# Altium schematic sheet 03_MSP430_AFE.SchDoc: Wearable Ultra Low-Power Ultrasound probe
size A3; DrawnBy: Sebastian Frey; Organization: Integrated Systems Laboratory; Revision: v1.2; SheetNumber: 4; SheetTotal: 6
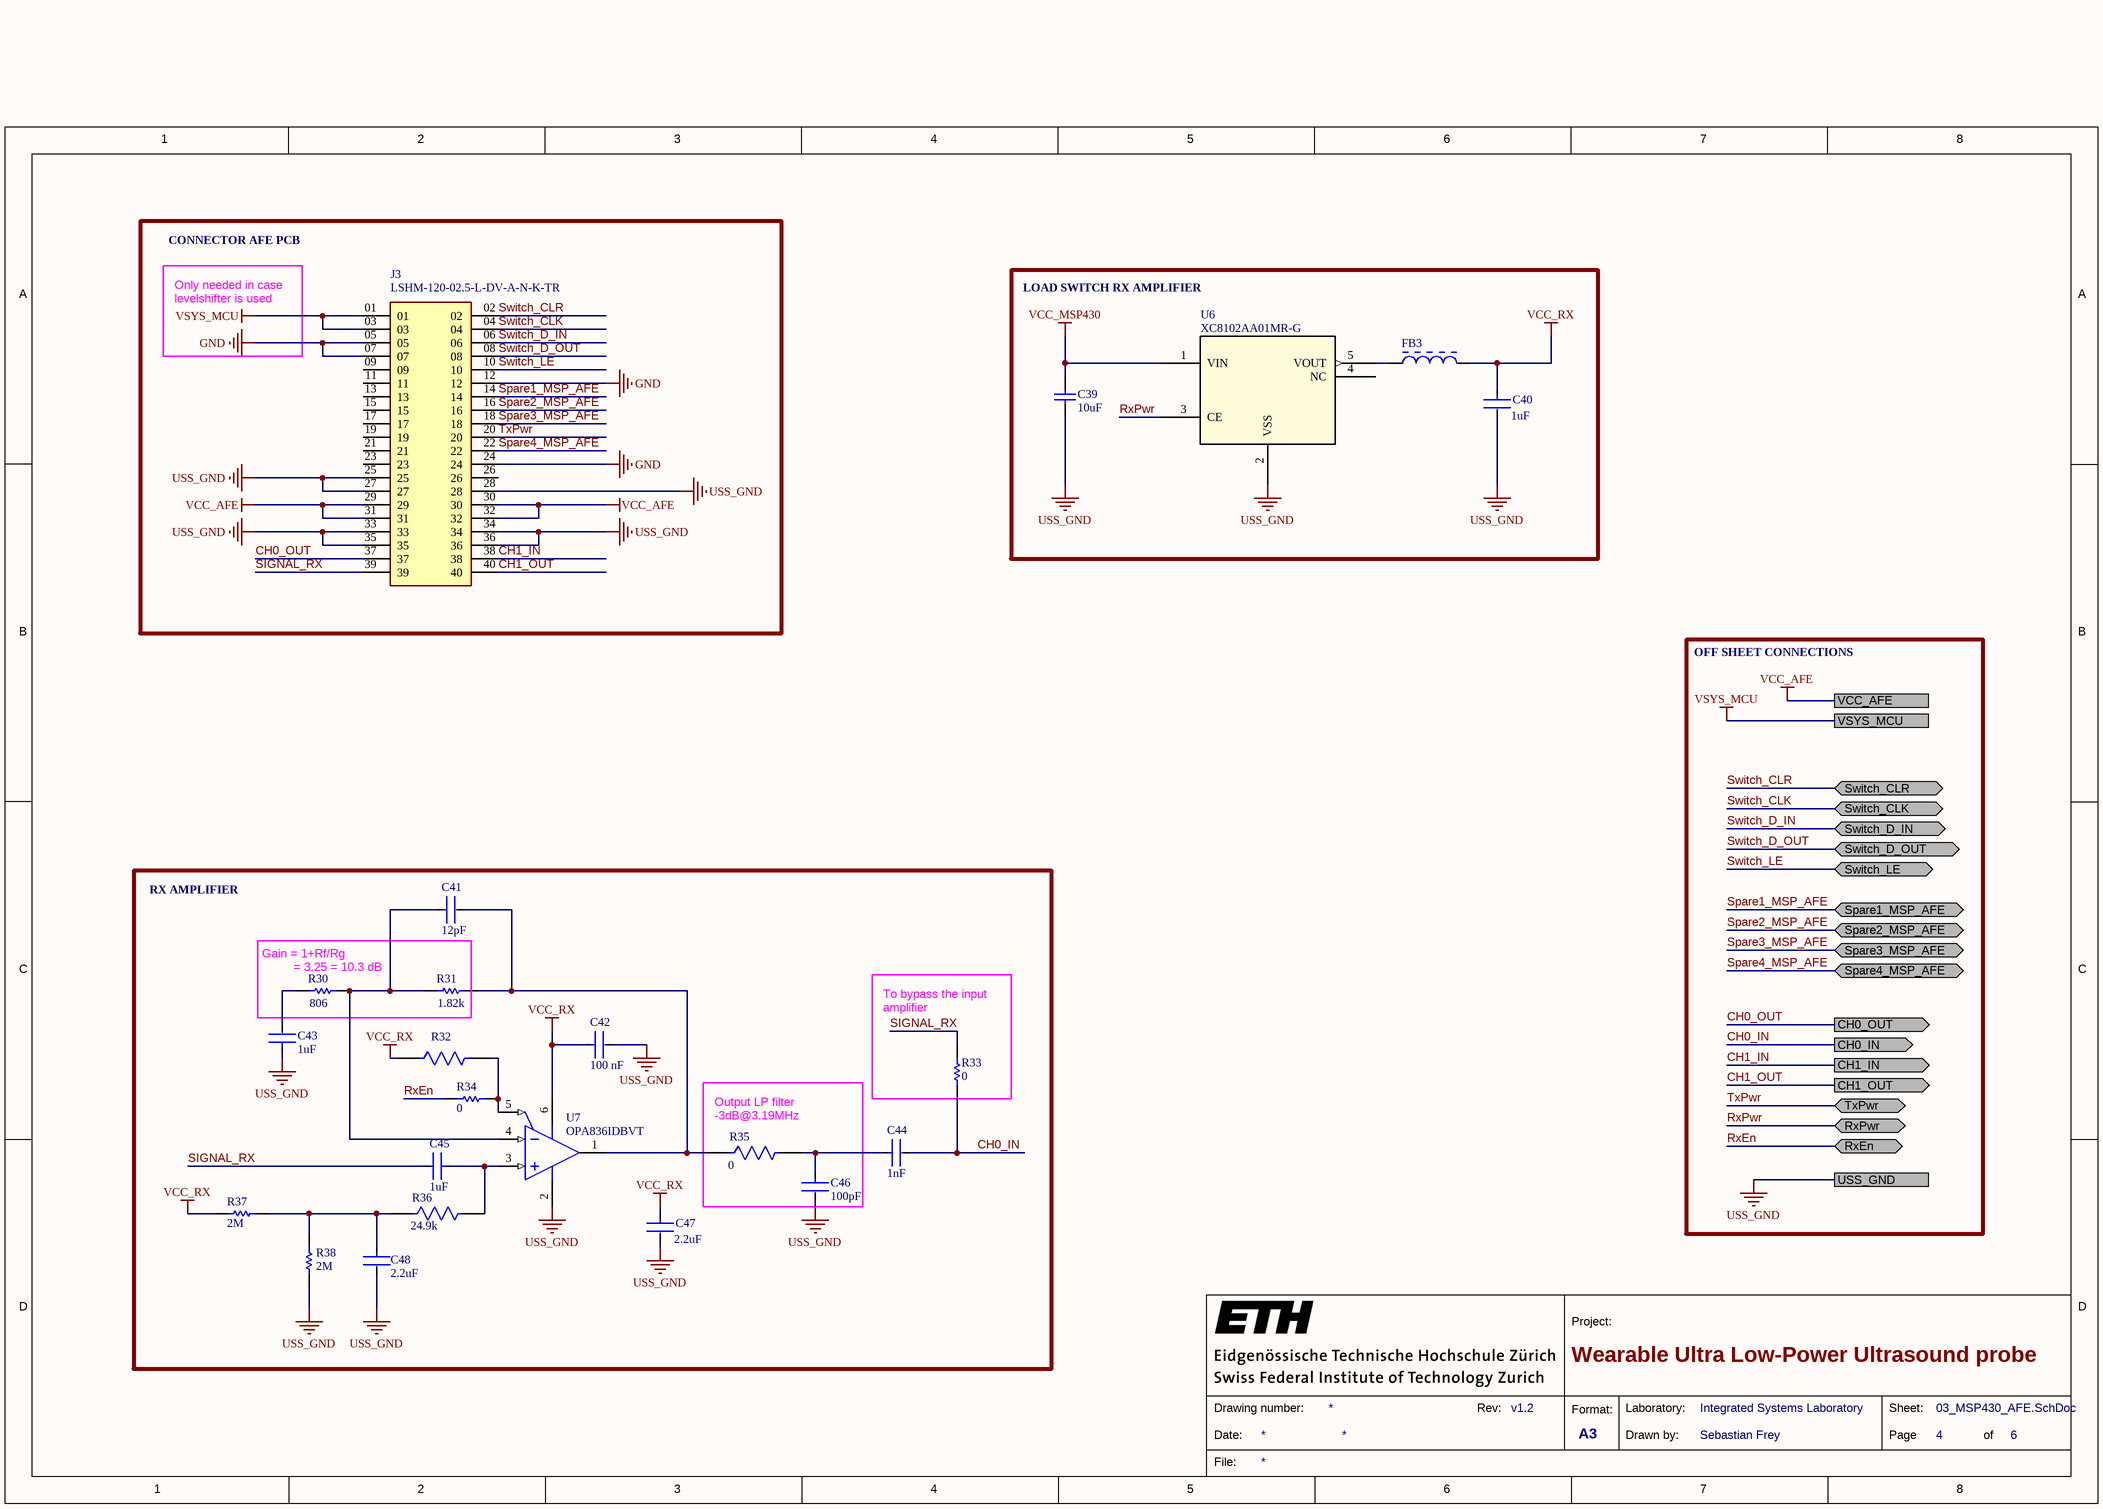
[diagram p0: 03_MSP430_AFE.SchDoc]

## Parts
C39  value 10uF  [CAPC0603(1608)100_L]  (hidden comment: C1608X5R1A106K080AC)
C40  Capacitance: 1uF  [FP-C1608-080-0_1-IPC_B]  (hidden comment: C1608X7R1C105K080AC)
C41  Capacitance: 12pF  [FP-GJM155-0_05-IPC_A]  (hidden comment: GJM1555C1H120GB01D)
C42  value 100 nF  [FP-CC0402-MFG]  (hidden comment: CC0402KRX7R7BB104)
C43  Capacitance: 1uF  [FP-C1608-080-0_1-IPC_B]  (hidden comment: C1608X7R1C105K080AC)
C44  Capacitance: 1nF  [FP-GRM155-0_05-IPC_B]  (hidden comment: GRM1555C1H102JA01D)
C45  Capacitance: 1uF  [FP-C1608-080-0_1-IPC_B]  (hidden comment: C1608X7R1C105K080AC)
C46  Capacitance: 100pF  [FP-04025A101JAT2A-MFG]  (hidden comment: 04025A101JAT2A)
C47  Capacitance: 2.2uF  [FP-CGA3E-0_3-0_1-MFG]  (hidden comment: GRM188R61C225KE15D)
C48  Capacitance: 2.2uF  [FP-CGA3E-0_3-0_1-MFG]  (hidden comment: GRM188R61C225KE15D)
FB3  BLM03AX800SN1D  [MURA-BLM03-CHIP-2_V]  (value not drawn)
J3  LSHM-120-02.5-L-DV-A-N-K-TR  [SAMTEC_LSHM-120-XX.X-X-DV-A-N-XX]
R30  Resistance: 806  [RESC1608X55X25LL10T15]  (hidden comment: RC0603FR-07806RL)
R31  Resistance: 1.82k  [RESC1608X55X25ML10T15]  (hidden comment: RC0603FR-071K82L)
R32  TNPW040210K0BEED  [FP-TNPW0402-e3-MFG]  (value not drawn)
R33  Resistance: 0  [RESC1005X40X25NL05T10]  (hidden comment: RC0402JR-070RL)
R34  Resistance: 0  [RESC1005X40X25NL05T10]  (hidden comment: RC0402JR-070RL)
R35  Resistance: 0  [FP-CR0402-IPC_B]  (hidden comment: CR0402-J/-000GLF)
R36  Resistance: 24.9k  [FP-RC_L0603-MFG]  (hidden comment: RC0603FR-0724K9L)
R37  Parameter 1: 2M  [RESC1608X55X30LL15T15]  (hidden comment: RC0603FR-072ML)
R38  Parameter 1: 2M  [RESC1608X55X30LL15T15]  (hidden comment: RC0603FR-072ML)
U6  XC8102AA01MR-G  [XC8102_SOT-25_TOR]
U7  OPA836IDBVT  [DBV0006A_L]

## Blocks framed on the sheet
CONNECTOR AFE PCB: J3
LOAD SWITCH RX AMPLIFIER: C39 C40 FB3 U6
RX AMPLIFIER: C41-C48 R30-R38 U7

## Ports
CH0_IN (out), CH0_OUT (out), CH1_IN (out), CH1_OUT (out), RxEn (bidir), RxPwr (bidir), Spare1_MSP_AFE (bidir), Spare2_MSP_AFE (bidir), Spare3_MSP_AFE (bidir), Spare4_MSP_AFE (bidir), Switch_CLK (bidir), Switch_CLR (bidir), Switch_D_IN (bidir), Switch_D_OUT (bidir), Switch_LE (bidir), TxPwr (bidir), USS_GND, VCC_AFE, VSYS_MCU

## Nets
GND: J3.05 J3.07 J3.12 J3.24
USS_GND: C39.1 C40.1 C42.2 C43.2 C46.1 C47.2 C48.2 J3.25 J3.27 J3.28 J3.33 J3.34 J3.35 J3.36 R38.1 U6.2(VSS) U7.2(VS-) ; port USS_GND
VCC_AFE: J3.29 J3.30 J3.31 J3.32 ; port VCC_AFE
VCC_MSP430: C39.2 U6.1(VIN)
VCC_RX: C40.2 C42.1 C47.1 FB3.2 R32.1 R37.2 U7.6(VS+)
VSYS_MCU: J3.01 J3.03 ; port VSYS_MCU
CH0_IN: C44.2 R33.1 ; port CH0_IN
CH0_OUT: J3.37 ; port CH0_OUT
CH1_IN: J3.38 ; port CH1_IN
CH1_OUT: J3.40 ; port CH1_OUT
RxEn: R34.2 ; port RxEn
RxPwr: U6.3(CE) ; port RxPwr
SIGNAL_RX: C45.1 J3.39 R33.2
Spare1_MSP_AFE: J3.14 ; port Spare1_MSP_AFE
Spare2_MSP_AFE: J3.16 ; port Spare2_MSP_AFE
Spare3_MSP_AFE: J3.18 ; port Spare3_MSP_AFE
Spare4_MSP_AFE: J3.22 ; port Spare4_MSP_AFE
Switch_CLK: J3.04 ; port Switch_CLK
Switch_CLR: J3.02 ; port Switch_CLR
Switch_D_IN: J3.06 ; port Switch_D_IN
Switch_D_OUT: J3.08 ; port Switch_D_OUT
Switch_LE: J3.10 ; port Switch_LE
TxPwr: J3.20 ; port TxPwr
NetC41_1: C41.1 R30.2 R31.1 U7.4(VIN-)
NetC41_2: C41.2 R31.2 R35.1 U7.1(VOUT)
NetC43_1: C43.1 R30.1
NetC44_1: C44.1 C46.2 R35.2
NetC45_2: C45.2 R36.2 U7.3(VIN+)
NetC48_1: C48.1 R36.1 R37.1 R38.2
NetFB3_1: FB3.1 U6.5(VOUT)
NetR32_2: R32.2 R34.1 U7.5(~{PD})

Not connected (* = marked no-connect by the designer): J3 09 11 13 15 17 19 21 23 26; U6 4(NC)

## Notes on the sheet
- Only needed in case levelshifter is used
- OFF SHEET CONNECTIONS
- (near R30) Gain = 1+Rf/Rg
  = 3.25 = 10.3 dB
- (near R33) To bypass the input amplifier
- (near R35) Output LP filter
  -3dB@3.19MHz
- 1
- 2
- 3
- 4
- 5
- 6
- 7
- 8
- A
- B
- C
- D
- Project:
- Date:
- Drawing number:
- Rev:
- Format:
- A3
- Drawn by:
- Laboratory:
- Page
- Sheet:
- of
- File:

## Library data of the parts
C39 = CMP-1035-02799-1: CAP 10uF 10V ±10% 0603 (1608 Metric) Thickness 1mm SMD; Tolerance: Â±10%; Case-Metric: 1608; Case-EIA: 0603; Max Thickness: 1 mm; Technology: SMT; Rated Voltage: 10 V
C40 C43 C45 = CMP-08246-002727-1: Multilayer Ceramic Capacitors 1μF ±10% 16V X7R SMD 0603; Mount: Surface Mount; Width: 0.031inch; Radiation Hardening: No; Dielectric Material: Ceramic; Packaging: Tape and Reel; Voltage Rating: 16V; Weight: 7.1E-05oz; Termination: SMD/SMT; Package Quantity: 1; Voltage Rating (DC): 16V; REACH SVHC: No SVHC; Voltage: 16V; Min Operating Temperature: -55°C; Depth: 0.8mm; Height: 0.8mm; Length: 1.6mm; Case Code (Metric): 1608; Thickness: 0.037inch; Lead Free: Lead Free; Resistor Type: Ceramic; RoHS Compliant: Yes; Series: C; Construction: Flat; Max Operating Temperature: 125°C; Tolerance: 10%; Case/Package: 0603; Dielectric: X7R; Case Code (Imperial): 0603
C41 = CMP-2008-03799-2: Multi-Layer Ceramic Capacitor 12pF C0G  ±2% 0402 Paper T/R; Voltage Rating: 50V; Tolerance: 2%; Length: 1mm; Width: 0.5mm; Thickness: 0.022inch; Package Quantity: 10000; Lead Free: Lead Free; Mount: Surface Mount; Voltage Rating (DC): 50V; Max Operating Temperature: 125°C; Termination: SMD/SMT; Depth: 0.5mm; Min Operating Temperature: -55°C; Height: 0.5mm; Case Code (Imperial): 0402; Case/Package: 0402; Case Code (Metric): 1005; Dielectric: C0G; Packaging: Tape and Reel; Radiation Hardening: No
C42 = CMP-03422-000048-1: CAP CER 0.1UF 16V X7R 0402; Manufacturer: YAGEO; Material: Ceramic; Automotive Grade: NA; Temperature Coefficient: 30ppm/°C; Tolerance: 0.1; Device Class L1: Passive Components; Temperature Range Low: -55°C; Device Class L3: Ceramic Capacitors; Temperature Characteristic: X7R; Ipc Land Pattern Name: CAPC10050X50; Capacitance: 100 nF; Temperature Range High: +125°C; Voltage Rating: 16 V; Temperature: -55°C to +125°C; RoHS: TRUE; Automotive: No; Height: 0.55mm; Device Class L2: Capacitors; Digikey Description: CAP CER 0.1UF 16V X7R 0402; Package: CC0402; Footprint Url: http://www.yageo.com/exep/pages/download/literatures/UPY-C_GEN_24.pdf; ComponentLink2Description: Datasheet; Category: Cap; Lead Free: Yes; Octopart: https://octopart.com/cc0402krx7r7bb104-yageo-42244624; ComponentLink2URL: http://www.yageo.com/documents/recent/UPY-GP_NP0_16V-to-50V_16.pdf; Manufacturer Part Number: CC0402KRX7R7BB104; Mouser Description: 0402 0.1 uF 16 V ±10 % Tolerance X7R SMT Multilayer Ceramic Capacitor
C44 = CMP-2008-04254-2: Chip Multilayer Ceramic Capacitors for General Purpose, 0402, 1000pF, C0G, 30ppm/°C, 5%, 50V; Insulation Resistance: 10GR; Packaging: Tape and Reel; Lead Free: Lead Free; Tolerance: 5%; Temperature Coefficient: 30ppm/°C; Thickness: 0.022inch; Termination: SMD/SMT; Max Operating Temperature: 125°C; Height: 0.5mm; Package Quantity: 1; Radiation Hardening: No; Material: Ceramic; Case Code (Metric): 1005; Number of Pins: 2; Voltage Rating: 50V; Mount: Surface Mount; Voltage: 50V; Case/Package: 0402; Min Operating Temperature: -55°C; Dielectric Material: Ceramic; Width: 0.5mm; Depth: 0.5mm; Case Code (Imperial): 0402; REACH SVHC: No SVHC; Dielectric: C0G; Voltage Rating (DC): 50V; Length: 1mm
C46 = CMP-2008-02568-2: CAP CER 100PF 50V C0G/NP0 0402; Tolerance: 5%; Insulation Resistance: 1GR; Dielectric: C0G; Dissipation Factor: 2.5%; Temperature Coefficient: 30ppm/°C; Depth: 0.5mm; Max Operating Temperature: 125°C; Voltage: 50V; Contact Plating: Tin; Width: 0.02inch; Radiation Hardening: No; Case/Package: 0402; Voltage Rating: 50V; Packaging: Tape and Reel; Termination: SMD/SMT; REACH SVHC: No SVHC; Case Code (Metric): 1005; Mount: Surface Mount; Package Quantity: 1; Height: 0.56mm; Construction: Flat; Case Code (Imperial): 0402; RoHS Compliant: Yes; Voltage Rating (DC): 50V; Thickness: 0.022inch; Series: -; Min Operating Temperature: -55°C; Lead Free: Lead Free; Length: 1mm
C47 C48 = CMP-08246-002299-1: Cap Ceramic 2.2uF 16V X5R 10% Pad SMD 0603 +85°C Automotive T/R; Max Operating Temperature: 85°C; Thickness: 0.035inch; Composition: Ceramic; Height: 0.8mm; Radiation Hardening: No; Tolerance: 10%; Package Quantity: 1; Case/Package: 0603; Case Code (Imperial): 0603; Termination: SMD/SMT; Depth: 0.8mm; Width: 0.031inch; Case Code (Metric): 1608; Dielectric: X5R; Voltage Rating (DC): 16V; Voltage Rating: 16V; Ratings: AEC-Q200; REACH SVHC: No SVHC; Mount: Surface Mount; Packaging: Tape and Reel; Min Operating Temperature: -55°C; Length: 1.6mm; Weight: 7.1E-05oz
FB3 = CMP-0686-00058-2: Chip Ferrite Bead for Power lines and Signal Lines, 80 Ohm, 500 mA, -55 to 125 degC, 0.6 x 0.3 x 0.33 mm SMD, Tape and Reel; Manufacturer: Murata; DC Resistance: 0.18 Ohm Max.; Rated Current: 500 mA; Impedance (at 100 MHz): 80 Ohm +/- 25%; Material: Steel; Impedance: 80R; Current Rating: 500mA; DC Resistance (DCR): 180mR; Test Frequency: 100MHz; Tolerance: 25%; Number of Lines: 1; PackageReference: BLM03-2; ComponentLink2URL: http://www.murata.com/products/catalog/pdf/c31e.pdf; ComponentLink2Description: Datasheet; ComponentLink1Description: Manufacturer URL; DatasheetVersion: 08/2013; ComponentLink1URL: http://www.murata.com/; ComponentLink3Description: Package Specification; ComponentLink3URL: http://www.murata.com/products/catalog/pdf/c31e.pdf; PackageDescription: 2-Pin Chip, Body 0.6 x 0.3 mm; Packing: Tape and Reel; Operating Temperature Range: -55 to 125 degC; Mounting Technology: Surface Mount; PartNumber: BLM03AX800SN1D; Supplier 1: Digi-Key; Supplier Part Number 1: 490-5621-1-ND; Manufacturer Part Number: BLM03AX800SN1D; RoHS: Yes; Category: Inductors; Stock 1: 13310; Pricing 1: 1=0.19000, 10=0.15200, 25=0.11840, 50=0.09820, 100=0.08470, 250=0.06776, 500=0.06098, 1000=0.05082, 5000=0.04743 (USD); Case/Package: 0201; Number of Pins: 2; Case Code (Metric): 0603; Case Code (Imperial): 0201; Min Operating Temperature: -55°C; Max Operating Temperature: 125°C; Package Quantity: 1; Packaging: Tape and Reel; Max DC Current: 500mA; Termination: SMD/SMT; Max Current Rating: 500mA; Number of Circuits: 1; Length: 0.6mm; Height: 0.3mm; Width: 0.3mm; REACH SVHC: No SVHC; ComponentLink4URL: https://datasheet.ciiva.com/1013/l0110s0100blm03ax-1013986.pdf?src-supplier=Digi-Key; ComponentLink4Description: https://datasheet.ciiva.com/1013/l0110s0100blm03ax-1013986.pdf?src-supplier=Digi-Key; ComponentLink5URL: https://datasheet.ciiva.com/41449/001172131-da-01-en-drossel-0201-80r-0-6x0-3mm-15000st-41449422.pdf?src-supplier=Conrad; ComponentLink5Description: https://datasheet.ciiva.com/41449/001172131-da-01-en-drossel-0201-80r-0-6x0-3mm-15000st-41449422.pdf?src-supplier=Conrad; ComponentLink6URL: https://datasheet.ciiva.com/1013/l0110e-1013987.pdf?src-supplier=Digi-Key; ComponentLink6Description: https://datasheet.ciiva.com/1013/l0110e-1013987.pdf?src-supplier=Digi-Key; ComponentLink7URL: https://datasheet.ciiva.com/1013/l0110e-1013988.pdf?src-supplier=Digi-Key; ComponentLink7Description: https://datasheet.ciiva.com/1013/l0110e-1013988.pdf?src-supplier=Digi-Key; ComponentLink8URL: https://datasheet.ciiva.com/46423/1851884-46423882.pdf?src-supplier=Element14; ComponentLink8Description: https://datasheet.ciiva.com/46423/1851884-46423882.pdf?src-supplier=Element14
J3 = LSHM-120-02.5-L-DV-A-N-K-TR: Conn Socket and Terminal Strip HDR/SKT 40 POS 0.5mm Solder ST SMD T/R; Manufacturer: Samtec; Number of Contacts: 40; Supplier 1: Digi-Key; RoHS: Yes; Category: Connectors; Stock 1: 3008; Pricing 1: 1=6.60000, 10=5.97000, 25=5.63960, 50=5.50200, 100=5.22690, 250=4.67672 (USD); Contact Plating: Gold; Contact Material: Bronze; Housing Color: Black; Housing Material: Polymer; Min Operating Temperature: -55°C; Max Operating Temperature: 125°C; Number of Rows: 2; Termination: Solder; Packaging: Tape and Reel; Orientation: Straight; Series: LSH; Length: 14.7mm; Pitch: 0.5mm; Depth: 4.98mm; Radiation Hardening: No; REACH SVHC: No SVHC; RoHS Compliant: Yes; ComponentLink1URL: http://www.farnell.com/datasheets/2372721.pdf?src-supplier=Farnell; ComponentLink1Description: http://www.farnell.com/datasheets/2372721.pdf?src-supplier=Farnell; ComponentLink2URL: http://www.farnell.com/datasheets/2000266.pdf?src-supplier=Farnell; ComponentLink2Description: http://www.farnell.com/datasheets/2000266.pdf?src-supplier=Farnell; ComponentLink3URL: http://components.arrow.com/part/dataview/0323_01943898?src-supplier=Arrow+Europe; ComponentLink3Description: http://components.arrow.com/part/dataview/0323_01943898?src-supplier=Arrow+Europe; ComponentLink4URL: http://components.arrow.com/part/dataview/48680868S8397842N1004?src-supplier=Arrow+Electronics; ComponentLink4Description: http://components.arrow.com/part/dataview/48680868S8397842N1004?src-supplier=Arrow+Electronics; ComponentLink5URL: http://www.farnell.com/datasheets/2000266.pdf?src-supplier=Element14; ComponentLink5Description: http://www.farnell.com/datasheets/2000266.pdf?src-supplier=Element14; ComponentLink6URL: http://suddendocs.samtec.com/prints/lshm-1xx-xx.x-xx-dv-a-x-x-tr-mkt.pdf?src-supplier=Digi-Key; ComponentLink6Description: http://suddendocs.samtec.com/prints/lshm-1xx-xx.x-xx-dv-a-x-x-tr-mkt.pdf?src-supplier=Digi-Key; ComponentLink7URL: ftp://ftp.samtec.com/webfiles/PDF/LSHM.PDF?src-supplier=Avnet; ComponentLink7Description: ftp://ftp.samtec.com/webfiles/PDF/LSHM.PDF?src-supplier=Avnet; ComponentLink8URL: ftp://ftp.samtec.com/webfiles/PDF/LSHM.PDF?src-supplier=Avnet+Europe; ComponentLink8Description: ftp://ftp.samtec.com/webfiles/PDF/LSHM.PDF?src-supplier=Avnet+Europe; ComponentLink9URL: http://www.farnell.com/datasheets/2372721.pdf?src-supplier=Newark; ComponentLink9Description: http://www.farnell.com/datasheets/2372721.pdf?src-supplier=Newark; Supplier Part Number 1: SAM13196CT-ND; Manufacturer Part Number: LSHM-120-02.5-L-DV-A-N-K-TR
R30 = CMP-2000-04142-1: Manufacturer: Yageo; Part Number: RC0603FR-07806RL
R31 = CMP-2000-03938-1: Manufacturer: Yageo; Part Number: RC0603FR-071K82L
R32 = CMP-2002-01683-2: RES 10K OHM 0.1% 1/10W 0402; Manufacturer: Vishay; Power Rating: 0.1W; Temperature Coefficient: 25ppm/°C; Automotive Grade: Grade 0; Voltage Rating: 50V; Resistance: 10kΩ; Automotive: Yes; Digikey Description: RES 10K OHM 0.1% 1/10W 0402; Device Class L2: Resistors; Manufacturer Part Number: TNPW040210K0BEED; Temperature: -55°C to +155°C; ComponentLink2Description: Datasheet; Ipc Land Pattern Name: RESC10050X35; Temperature Range High: +155°C; Composition: Thin Film; Tolerance: 0.1%; Device Class L3: Chip SMD Resistors; Package: TNPW0402-e3; Octopart: https://octopart.com/tnpw040210k0beed-vishay-41229038; Device Class L1: Passive Components; Series: TNPW; Value: 10k; Temperature Range Low: -55°C; Height: 0.4mm; Category: Res; Lead Free: Yes; RoHS: TRUE; ComponentLink2URL: http://www.vishay.com/docs/28758/tnpw_e3.pdf
R33 R34 = CMP-1011-00001-2: Manufacturer: Yageo / Phycomp; Part Number: RC0402JR-070RL
R35 = CMP-2002-05495-2: Thick Film Chip Resistors 0402 0Ω 0.0625W 5%; Voltage Rating (DC): 50V; Max Power Dissipation: 63mW; Temperature Coefficient: 500ppm/°C; Power Rating: 62.5mW; Depth: 0.5mm; Packaging: Tape and Reel; REACH SVHC: No SVHC; Max Operating Temperature: 125°C; Case Code (Metric): 1005; Case Code (Imperial): 0402; Case/Package: 0402; Number of Pins: 2; Thickness: 356um; Composition: Thick Film; Voltage Rating: 50V; Min Operating Temperature: -55°C; Tolerance: 5%; Radiation Hardening: No; Height: 0.35mm; Termination: SMD/SMT; Width: 0.5mm; Mount: Surface Mount; Package Quantity: 10000; Contact Plating: Tin; Length: 1mm
R36 = CMP-03412-013083-1: RES SMD 24.9K OHM 1% 1/10W 0603; Manufacturer: Yageo; Approved Alternate Part Number: 541-1.00HHCT-ND; Voltage Rating: 75V; Power Rating: 0.1W; Value: 24.9kΩ; Power: 100mW; Temperature Coefficient: 100ppm/°C; Footprint Url: https://www.yageo.com/upload/website/yageo_PYu-R_Mount_10_19050818_343.pdf; Automotive: No; Temperature Range Low: -55°C; Manufacturer Part Number: RC0603FR-0724K9L; Ipc Land Pattern Name: RESC16080X45; Digikey Description: RES SMD 24.9K OHM 1% 1/10W 0603; Voltage: 75V; Composition: Thick Film; Device Class L1: Passive Components; Device Class L2: Resistors; Device Class L3: Chip SMD Resistors; ComponentLink2URL: https://www.yageo.com/upload/media/product/productsearch/datasheet/rchip/PYu-RC_Group_51_RoHS_L_10.pdf; Series: RC_L; Octopart: https://octopart.com/rc0603fr-0724k9l-yageo-1189838; RoHS: TRUE; Category: Res; Height: 0.55mm; Tolerance: 1%; Temperature: -55°C to +155°C; Temperature Range High: +155°C; ComponentLink2Description: Datasheet; Package: RC_L0603; Lead Free: Yes; Mouser Description: Res Thick Film 1.6 x 0.8 mm 24.9K Ohm 1% 0.1W(1/10W) 100ppm/ C Molded SMD Paper T/R
R37 R38 = CMP-2000-00320-1: Manufacturer: YAEGO; Part Number: RC0603FR-072ML
U6 = XC8102AA01MR-G: No Description Available; Mfr_Name: Torex Semiconductor; Copyright: Copyright (C) 2021 Ultra Librarian. All rights reserved.; Manufacturer_Part_Number: XC8102AA01MR-G; RefDes: RefDes; Type: DEV
U7 = CMP-0018-00480-2: Very Low Power, Rail to Rail Out, Negative Rail In, VFB Operational Amplifier, 2.5 to 5.5 V, -40 to 125 degC, 6-pin SOT23 (DBV6), Green (RoHS & no Sb/Br); Manufacturer: Texas Instruments; Iq per channel(Max)(mA): 1; Settling Time (0.1%)(Typ)(ns): 30; Vs(Min)(V): 2.5; Vio(Max)(mV): 0.4; 3rd Harmonic(dBc): 105; BW @ Acl(MHz): 205; Vs(Max)(V): 5.5; 2nd Harmonic(dBc): 85; Sub Family: Audio Operational Amplifier, High Output Current Amplifier (>=50mA), High Speed Amplifier (>=50MHz), Low Noise Amp (<=10nV/rtHz), Low Offset Voltage Amplifier (<=500uV), Low Supply Voltage Amplifier (<=2.7V); Vn at Flatband(Typ)(nV/rtHz): 4.6; Iib(Max)(nA): 1000; Slew Rate(Typ)(V/us): 560; Io(Typ)(mA): 50; Number of Channels: 1; Eco-Plan: Green (RoHS & no Sb/Br); PartNumber: OPA836IDBVT; ComponentLink3URL: http://www.ti.com/litv/pdf/mpds026h; ComponentLink3Description: Package Specification; @ MHz: 1; ComponentLink1Description: Manufacturer URL; ComponentLink2URL: http://www.ti.com/general/docs/lit/getliterature.tsp?genericPartNumber=OPA836&fileType=pdf; Acl, min stable gain(V/V): 1; PackageVersion: 4073253-5/K, 03/2006; PackageDescription: 6-Pin Plastic Small Outline, Body 1.6 x 2.9 mm, Pitch 0.95 mm; ComponentLink1URL: http://www.ti.com/; ComponentLink2Description: Datasheet; PackageReference: DBV0006A; Code_JEDEC: MO-178; DatasheetVersion: SLOS712D; Mounting Technology: Surface Mount